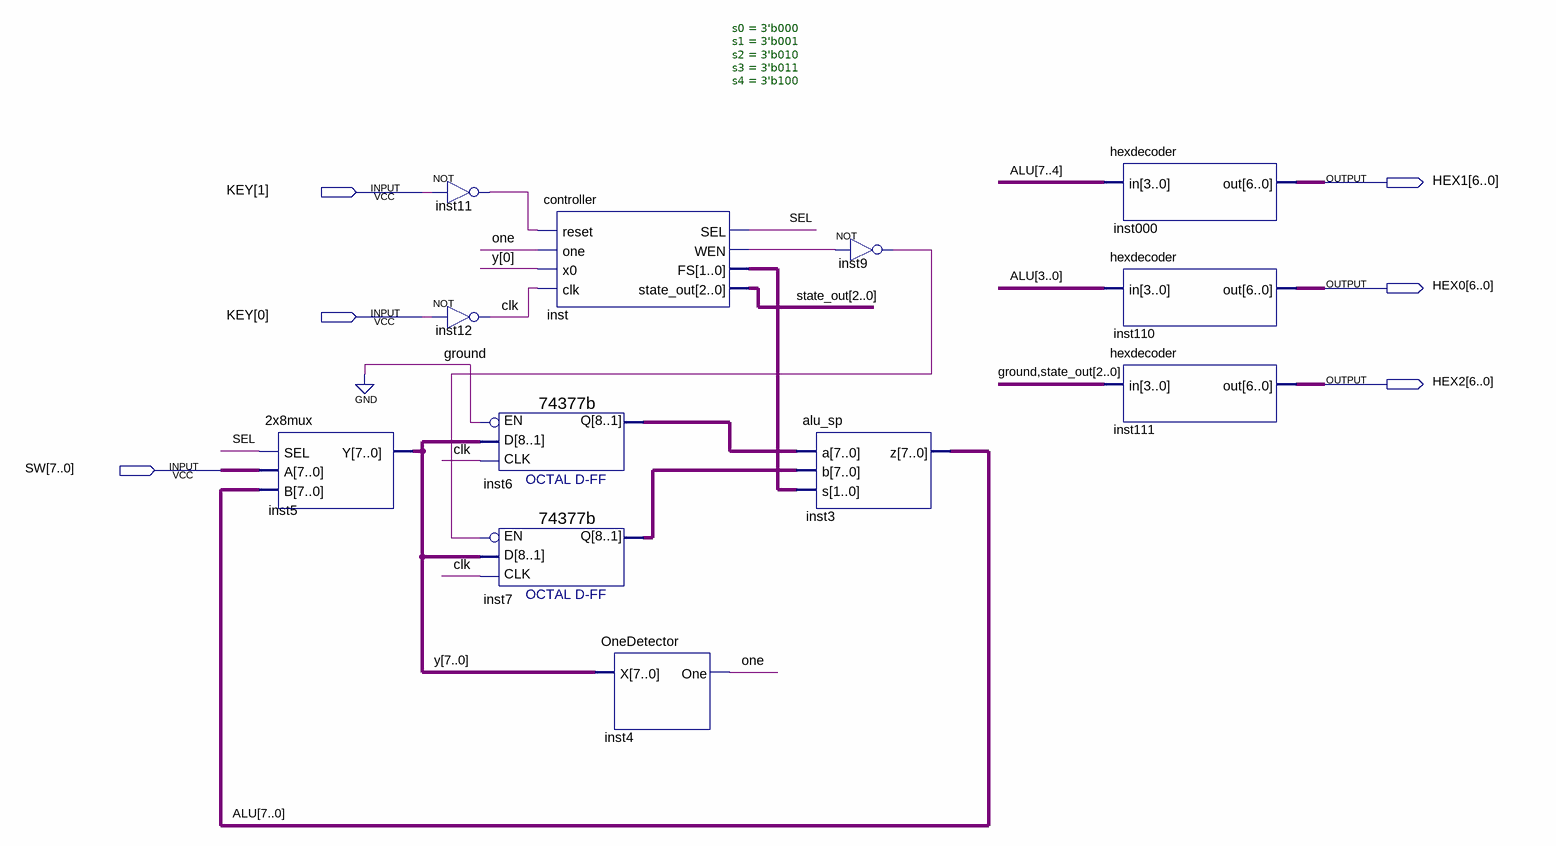
[diagram p0: schematic sheet]
// Quartus schematic Lab3.bdf as structural Verilog: 12 symbols, 6 pins
module Lab3 (
  input  [1:0] KEY,
  input  [7:0] SW,
  output [6:0] HEX1,
  output [6:0] HEX0,
  output [6:0] HEX2
);

  wire clk, inst9_out, inst11_out, inst_wen, one, SEL;
  wire [1:0] inst_fs;
  wire [2:0] state_out;
  wire [7:0] ALU, inst6_q, inst7_q, y;

  \2x8mux  inst5 (.SEL(SEL), .A(SW), .B(ALU), .Y(y));
  not inst11 (inst11_out, KEY[1]);
  not inst12 (clk, KEY[0]);
  \74377b  inst6 (.CLK(clk), .EN(1'b0), .D(y), .Q(inst6_q));
  \74377b  inst7 (.CLK(clk), .EN(inst9_out), .D(y), .Q(inst7_q));
  controller #(.s0(3'b000), .s1(3'b001), .s2(3'b010), .s3(3'b011), .s4(3'b100)) inst (
    .reset(inst11_out), .one(one), .x0(y[0]), .clk(clk), .SEL(SEL), .WEN(inst_wen), .FS(inst_fs),
    .state_out(state_out));
  OneDetector inst4 (.X(y), .One(one));
  alu_sp inst3 (.a(inst6_q), .b(inst7_q), .s(inst_fs), .z(ALU));
  not inst9 (inst9_out, inst_wen);
  hexdecoder inst000 (.in(ALU[7:4]), .out(HEX1));
  hexdecoder inst110 (.in(ALU[3:0]), .out(HEX0));
  hexdecoder inst111 (.in({1'b0, state_out}), .out(HEX2));
endmodule
